# Altium schematic sheet SW_ANT.SchDoc
size A; SheetNumber: 6; SheetTotal: 7
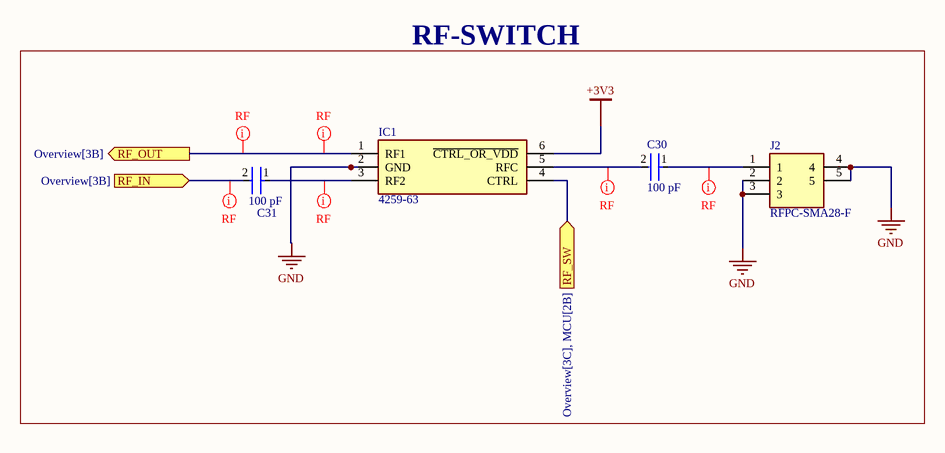
[diagram p0: SW_ANT.SchDoc]

## Parts
C30  100 pF  [FP-GQM187-0_15-MFG]
C31  100 pF  [FP-GQM187-0_15-MFG]
IC1  4259-63  [SOT65P210X110-6N]
J2  RFPC-SMA28-F  [RFPCSMA28F]

## Blocks framed on the sheet
RF-SWITCH: C30 C31 IC1 J2

## Ports
RF_IN (in, see Overview[3B]), RF_OUT (out, see Overview[3B]), RF_SW (in, see Overview[3C], MCU[2B])

## Nets
+3V3: IC1.6(~{CTRL_OR_VDD})
GND: IC1.2(GND) J2.2 J2.3 J2.4 J2.5
RF_IN: C31.2 ; port RF_IN
RF_OUT: IC1.1(RF1) ; port RF_OUT
RF_SW: IC1.4(CTRL) ; port RF_SW
NetC30_1: C30.1 J2.1
NetC30_2: C30.2 IC1.5(RFC)
NetC31_1: C31.1 IC1.3(RF2)

## Layout directives
rule Impedance Constraint [Min = 50.00    Max = 50.00    ]; net class RF: NetC30_1, NetC30_2, NetC31_1, RF_IN, RF_OUT

## Library data of the parts
C30 C31 = CMP-06035-018516-1: Ceramic Capacitor 100pF ±5% 250VDC C0G 0603 Paper T/R Name: GQM1875C2E101JB12D; Voltage Rating (DC): 250V; Min Operating Temperature: -55°C; Case Code (Metric): 1608; Lead Free: Lead Free; Length: 1.6mm; Voltage Rating: 250V; Termination: SMD/SMT; Packaging: Tape and Reel; Width: 0.031inch; Tolerance: 5%; Thickness: 0.031inch; Capacitance: 100pF; Package Quantity: 4000; Case/Package: 0603; Mount: Surface Mount; Max Operating Temperature: 125°C; Dielectric: C0G; Depth: 0.8mm; Case Code (Imperial): 0603
IC1 = 4259-63: Integrated Circuit; Manufacturer_Name: Peregrine Semiconductor; Datasheet Link: http://www.psemi.com/pdf/datasheets/pe4259ds.pdf; Height: 1.1mm; Manufacturer_Part_Number: 4259-63; Mouser Part Number: 81-4259-63; Mouser Price/Stock: https://www.mouser.co.uk/ProductDetail/pSemi/4259-63?qs=iw0hurA%2FaD37qvQcKdATTw%3D%3D
J2 = RFPC-SMA28-F: Connector; Manufacturer_Name: GCT (GLOBAL CONNECTOR TECHNOLOGY); Datasheet Link: https://www.mouser.kr/datasheet/3/1507/1/RFPC-SMA28-F.pdf; Height: 9.8mm; Manufacturer_Part_Number: RFPC-SMA28-F